# EAGLE design 16chADXIAO (EAGLE 9.6.2)
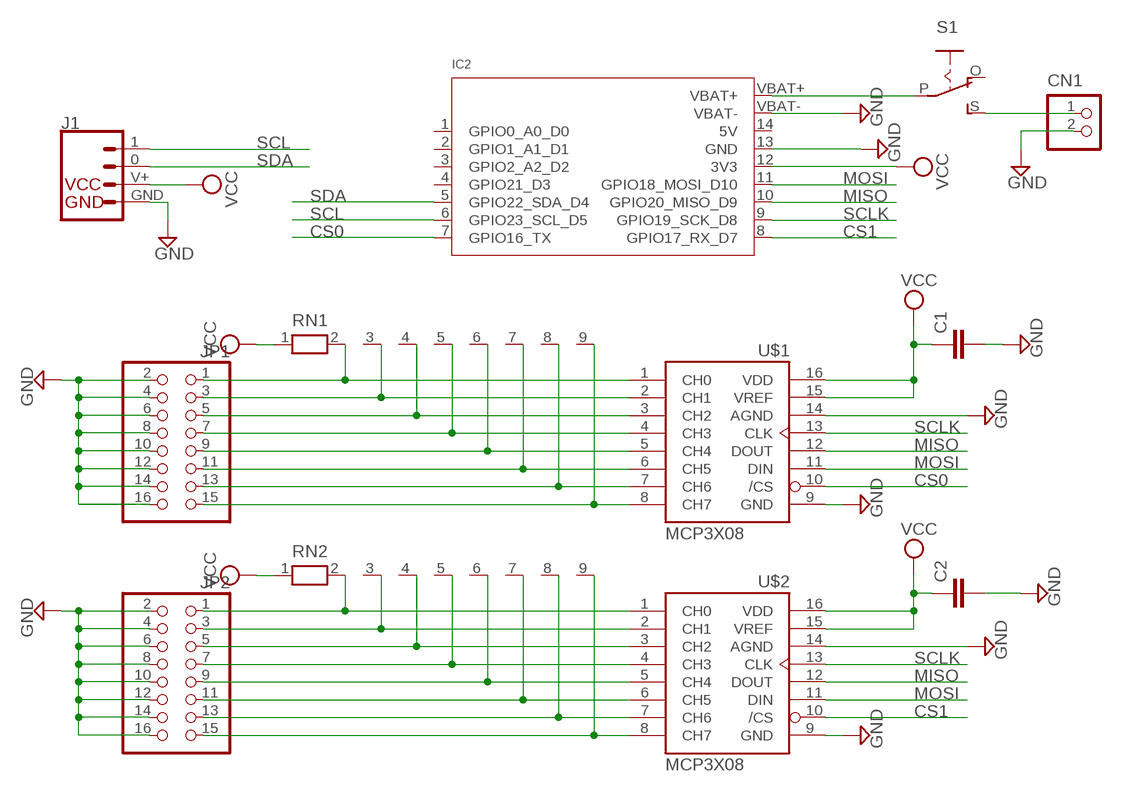
[diagram p0: schematic, sheet 1]

## Parts
C1  C-EUC0805  [C0805]
C2  C-EUC0805  [C0805]
CN1  B2B-PH-K-S  [B2B-PH-K-S]
IC2  MOUDLE-XIAO-ESO32C6  [XIAO-ESP32C6]
J1  4P-2.0  GROVE-CONNECTOR-DIP90D  [HW4-2.0-90D]
JP1  PINHD-2X8/90  [2X08/90]
JP2  PINHD-2X8/90  [2X08/90]
RN1  RN08  [RN-9]
RN2  RN08  [RN-9]
S1  EG1218S  [EG1218]
U$1  MCP3X08  [SO16]
U$2  MCP3X08  [SO16]

## Nets
CS0: IC2.7(GPIO16_TX) U$1.10(/CS)
CS1: IC2.8(GPIO17_RX_D7) U$2.10(/CS)
GND: C1.2 C2.2 CN1.2 IC2.13(GND) IC2.VBAT- J1.GND JP1.2 JP1.4 JP1.6 JP1.8 JP1.10 JP1.12 JP1.14 JP1.16 JP2.2 JP2.4 JP2.6 JP2.8 JP2.10 JP2.12 JP2.14 JP2.16 U$1.9(GND) U$1.14(AGND) U$2.9(GND) U$2.14(AGND)
MISO: IC2.10(GPIO20_MISO_D9) U$1.12(DOUT) U$2.12(DOUT)
MOSI: IC2.11(GPIO18_MOSI_D10) U$1.11(DIN) U$2.11(DIN)
N$1: JP1.1 RN1.2 U$1.1(CH0)
N$2: JP1.3 RN1.3 U$1.2(CH1)
N$3: JP1.5 RN1.4 U$1.3(CH2)
N$4: JP1.7 RN1.5 U$1.4(CH3)
N$5: JP1.9 RN1.6 U$1.5(CH4)
N$6: JP1.11 RN1.7 U$1.6(CH5)
N$7: JP1.13 RN1.8 U$1.7(CH6)
N$8: JP1.15 RN1.9 U$1.8(CH7)
N$9: JP2.1 RN2.2 U$2.1(CH0)
N$10: JP2.3 RN2.3 U$2.2(CH1)
N$11: JP2.5 RN2.4 U$2.3(CH2)
N$12: JP2.7 RN2.5 U$2.4(CH3)
N$13: JP2.9 RN2.6 U$2.5(CH4)
N$14: JP2.11 RN2.7 U$2.6(CH5)
N$15: JP2.13 RN2.8 U$2.7(CH6)
N$16: JP2.15 RN2.9 U$2.8(CH7)
N$17: IC2.VBAT+ S1.P
N$18: CN1.1 S1.S
SCL: IC2.6(GPIO23_SCL_D5) J1.1
SCLK: IC2.9(GPIO19_SCK_D8) U$1.13(CLK) U$2.13(CLK)
SDA: IC2.5(GPIO22_SDA_D4) J1.0
VCC: C1.1 C2.1 IC2.12(3V3) J1.V+(VCC) RN1.1 RN2.1 U$1.15(VREF) U$1.16(VDD) U$2.15(VREF) U$2.16(VDD)
Unconnected: IC2.1(GPIO0_A0_D0) IC2.2(GPIO1_A1_D1) IC2.3(GPIO2_A2_D2) IC2.4(GPIO21_D3) IC2.14(5V) S1.O

## Library data of the parts
C1 C2 = rcl:C-EU: CAPACITOR, European symbol; SPICEPREFIX: C
CN1 = jst-ph:B2B-PH-*: Wire-to-Board 2.0mm pitch top mount connector Source: http://www.jst-mfg.com/product/pdf/jpn/PH.pdf http://www.jst-mfg.com/product/detail.php?series=199
IC2 = Seeeduino XIAO:MOUDLE-XIAO-ESO32C6
J1 = SEEED-GROVE-CONNECTOR:GROVE-CONNECTOR-DIP: 320110033
JP1 JP2 = pinhead:PINHD-2X8: PIN HEADER
RN1 RN2 = resistor-net:RN08: RESISTOR NETWORK; OC_FARNELL: unknown; OC_NEWARK: unknown
S1 = adafruit:EG1218: SLIDING SWITCH 0.1" spacing through hole, vertical SPDT slide switch http://www.ladyada.net/library/pcb/eaglelibrary.html
U$1 U$2 = sensors:MCP3X08

## Board
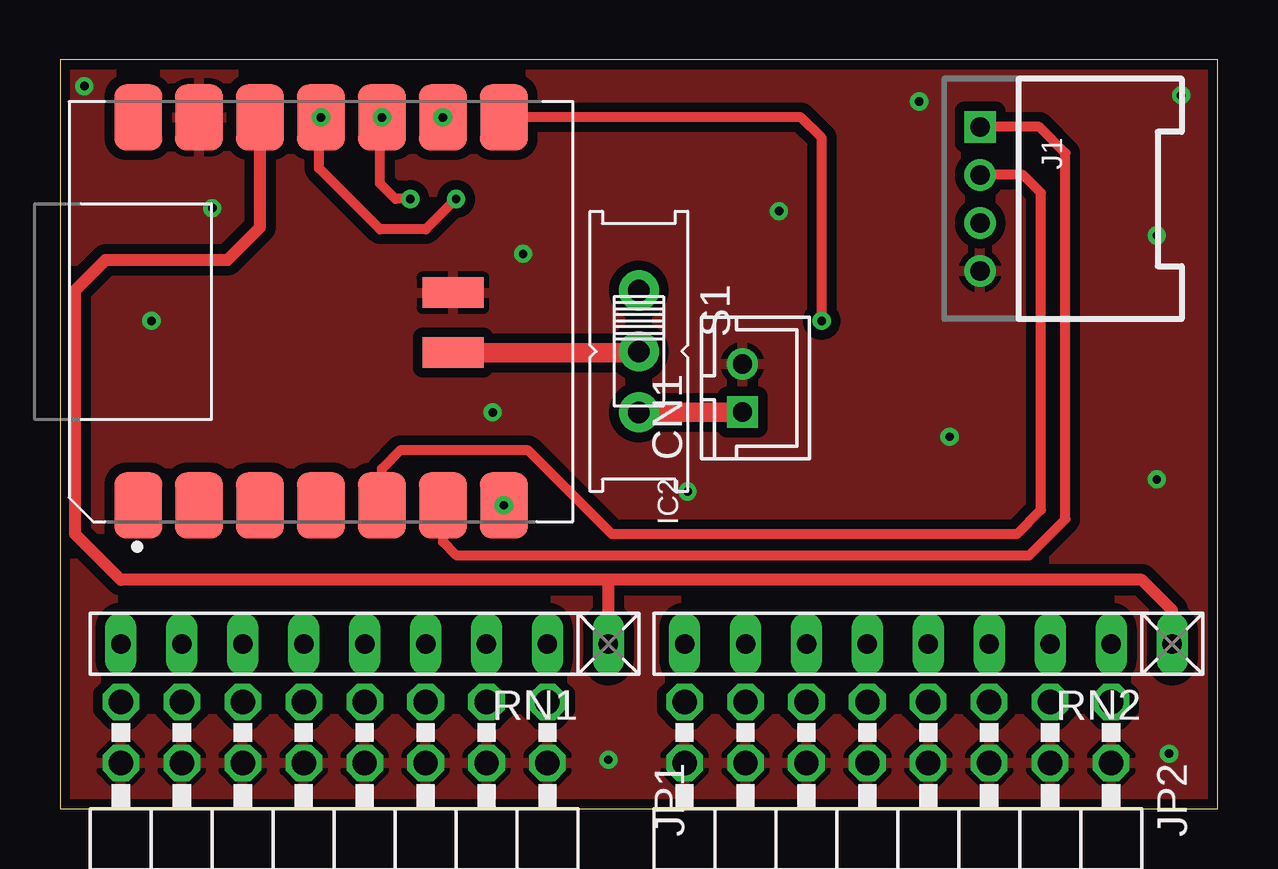
[diagram p1: board, top side]
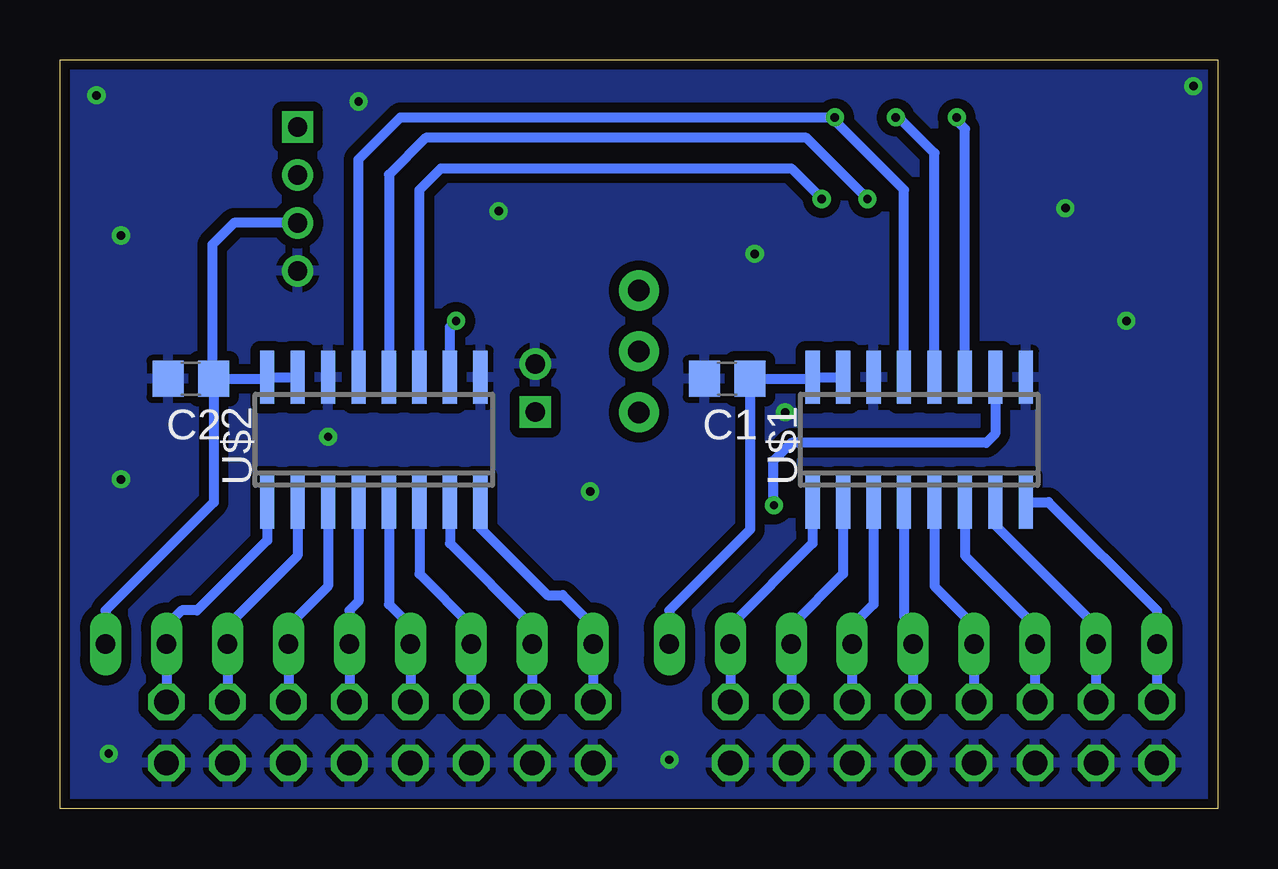
[diagram p2: board, bottom side, seen from below]

Size 48.26 x 31.19 mm. Coordinates in mm from the lower left corner, seen from the top.
Outline: 0,0 48.26,0 48.26,31.19 0,31.19 0,0
Copper layers (1*16): Top 0.035mm / dielectric 1.5mm / Bottom 0.035mm
Design rules "default *": minimum track width 6mil, minimum drill 0.35mm, track to track 6mil, track to pad 6mil, pad to pad 6mil, via to via 6mil, smd to smd 6mil, copper to edge 1mil, drill to drill 6mil, minimum pad ring 10mil, minimum via ring 8mil, stop-mask expansion 4mil, vias tented up to drill 0mil, thermal gap 10mil

### Footprints (pad centres in the part's own frame; a part is rotated, then mirrored left to right if it is on the bottom)
C0805 = smd 1.3 x 1.5: 1 -0.95,0; 2 0.95,0
B2B-PH-K-S = drill 0.8 square: 1 -1,0 | drill 0.8: 2 1,0
XIAO-ESP32C6 = smd 2.75 x 2: 1 -8.065,-2.88; 2 -8.065,-5.42; 3 -8.065,-7.96; 4 -8.065,-10.5; 5 -8.065,-13.04; 6 -8.065,-15.58; 7 -8.065,-18.12; 8 8.1,-18.12; 9 8.1,-15.58; 10 8.1,-13.04; 11 8.1,-10.5; 12 8.1,-7.96; 13 8.1,-5.42; 14 8.1,-2.88 | smd 1.27 x 2.54: VBAT+ -1.7,-16; VBAT- 0.8,-16
HW4-2.0-90D = drill 0.8 pad 1.27: 0 -1,0; GND 3,0; V+ 1,0 | drill 0.8 pad 1.27 square: 1 -3,0
2X08/90 = drill 1.016 octagon: 1 -8.89,-6.35; 2 -8.89,-3.81; 3 -6.35,-6.35; 4 -6.35,-3.81; 5 -3.81,-6.35; 6 -3.81,-3.81; 7 -1.27,-6.35; 8 -1.27,-3.81; 9 1.27,-6.35; 10 1.27,-3.81; 11 3.81,-6.35; 12 3.81,-3.81; 13 6.35,-6.35; 14 6.35,-3.81; 15 8.89,-6.35; 16 8.89,-3.81
RN-9 = drill 0.813 long: 1 -10.16,0; 2 -7.62,0; 3 -5.08,0; 4 -2.54,0; 5 0,0; 6 2.54,0; 7 5.08,0; 8 7.62,0; 9 10.16,0
EG1218 = drill 0.9 pad 1.676: O -2.54,0; P 0,0; S 2.54,0
SO16 = smd 0.6 x 2.2: 1 -4.445,-2.6; 2 -3.175,-2.6; 3 -1.905,-2.6; 4 -0.635,-2.6; 5 0.635,-2.6; 6 1.905,-2.6; 7 3.175,-2.6; 8 4.445,-2.6; 9 4.445,2.6; 10 3.175,2.6; 11 1.905,2.6; 12 0.635,2.6; 13 -0.635,2.6; 14 -1.905,2.6; 15 -3.175,2.6; 16 -4.445,2.6

### Placement (x,y rotation side)
C1  20.45,17.91 180 bottom
C2  42.8,17.91 180 bottom
CN1  28.45,17.53 90 top
IC2  0.38,20.7 90 top
J1  38.35,25.4 270 top
JP1  11.43,-1.91 180 top
JP2  34.93,-1.91 180 top
RN1  12.7,6.86 180 top
RN2  36.2,6.86 180 top
S1  24.13,19.05 270 top
U$1  12.45,15.37 0 bottom
U$2  35.18,15.37 0 bottom

### Tracks (layer width: path | path; a pad name or v marks a point on that pad's centre or on a via)
CS0  (via drill 0.35)
  Bottom 0.406: U$1.10 9.27,15.62 9.65,15.24 17.78,15.24 18.54,14.48 18.54,12.68 IC2.7
  other vias: 18.5,12.64
CS1  (via drill 0.35)
  Top 0.406: v31.75,20.32 31.75,27.94 30.89,28.8 IC2.8
  Bottom 0.406: U$2.10 32,20.07 v31.75,20.32
GND  (via drill 0.35)
  other vias: 1.02,30.1 3.81,20.32 26.16,13.21 22.86,2.03 46.23,2.29 45.72,13.72 46.74,29.72 45.72,23.88 35.81,29.46 29.97,24.89 19.3,23.11 6.35,25.02 18.03,16.51 37.08,15.49
  pour Top (isolate 0.406): -3.56,38.35 -3.56,-2.54 50.8,-2.54 50.8,38.35
  pour Bottom (isolate 0.406): -6.35,40.64 -6.35,-3.81 52.07,-3.81 52.07,40.64
MISO  (via drill 0.35)
  Top 0.406: v14.61,25.4 13.97,25.4 13.33,26.04 13.33,28.71 IC2.10
  Bottom 0.406: U$1.12 11.81,27.3 13.31,28.8 IC2.10 | v14.61,25.4 17.14,27.94 33.02,27.94 34.54,26.42 U$2.12
  other vias: 13.42,28.8
MOSI  (via drill 0.35)
  Top 0.406: v16.51,25.4 15.24,24.13 13.33,24.13 10.79,26.67 10.79,28.71 IC2.11
  Bottom 0.406: U$1.11 10.54,28.32 10.92,28.7 10.92,28.76 IC2.11 | U$2.11 33.27,25.78 32.38,26.67 17.78,26.67 v16.51,25.4
  other vias: 10.88,28.8
N$1
  Bottom 0.406: U$1.1 16.89,11.05 20.32,7.62 RN1.2 JP1.1
N$2
  Bottom 0.406: U$1.2 15.62,9.78 17.78,7.62 RN1.3 JP1.3
N$3
  Bottom 0.406: U$1.3 14.35,8.51 15.24,7.62 RN1.4 JP1.5
N$4
  Bottom 0.406: U$1.4 13.08,8 12.7,7.62 RN1.5 JP1.7
N$5
  Bottom 0.406: U$1.5 11.81,9.27 10.16,7.62 RN1.6 JP1.9
N$6
  Bottom 0.406: U$1.6 10.54,10.54 7.62,7.62 RN1.7 JP1.11
N$7
  Bottom 0.406: U$1.7 9.27,11.81 5.08,7.62 RN1.8 JP1.13
N$8
  Bottom 0.406: U$1.8 7.05,12.77 2.54,8.26 RN1.9 JP1.15
N$9
  Bottom 0.406: U$2.1 39.62,11.18 42.55,8.26 43.18,8.26 43.82,7.62 RN2.2 JP2.1
N$10
  Bottom 0.406: U$2.2 38.35,10.54 41.28,7.62 RN2.3 JP2.3
N$11
  Bottom 0.406: U$2.3 37.08,9.27 38.74,7.62 RN2.4 JP2.5
N$12
  Bottom 0.406: U$2.4 35.81,8.64 36.2,8.26 RN2.5 JP2.7
N$13
  Bottom 0.406: U$2.5 34.54,8.51 33.66,7.62 RN2.6 JP2.9
N$14
  Bottom 0.406: U$2.6 33.27,9.78 31.11,7.62 RN2.7 JP2.11
N$15
  Bottom 0.406: U$2.7 32,11.05 28.57,7.62 RN2.8 JP2.13
N$16
  Bottom 0.406: U$2.8 30.73,11.68 27.94,8.89 27.3,8.89 26.04,7.62 RN2.9 JP2.15
N$17
  Top 0.508: 24.08,19 S1.P
  Top 0.813: IC2.VBAT+ 24.08,19
N$18
  Top 0.508: 28.43,16.51 CN1.1
  Top 0.813: S1.S 28.43,16.51
SCL
  Top 0.406: 38.4,28.45 J1.1 40.82,28.4 41.91,27.3 41.91,12.06 40.39,10.54 16.53,10.54 15.96,11.11 IC2.6
SCLK  (via drill 0.35)
  Bottom 0.406: U$1.13 13.08,25.78 15.96,28.66 IC2.9 34.06,28.8 35.81,27.05 U$2.13
  other vias: 15.96,28.8
SDA
  Top 0.406: 38.37,26.42 38.36,26.41 | 38.36,26.41 J1.0 | 38.36,26.41 40.14,26.41 40.89,25.65 40.89,12.45 39.88,11.43 23.01,11.43 19.52,14.92 14.18,14.92 13.42,14.16 IC2.5
VCC
  Top 0.508: RN2.1 46.36,8.26 45.09,9.53 22.86,9.53 | IC2.12 8.34,24.22 6.98,22.86 1.91,22.86 0.64,21.59 0.64,11.43 2.54,9.53 22.86,9.53 | RN1.1 22.86,9.53
  Bottom 0.406: U$1.15 U$1.16 16.95,17.91 C1.1 19.5,11.62 22.86,8.26 RN1.1 | C2.1 39.68,17.91 U$2.16 U$2.15 | C2.1 41.85,12.76 46.36,8.26 RN2.1 | J1.V+ 41.01,24.4 41.91,23.5 41.91,17.97 C2.1